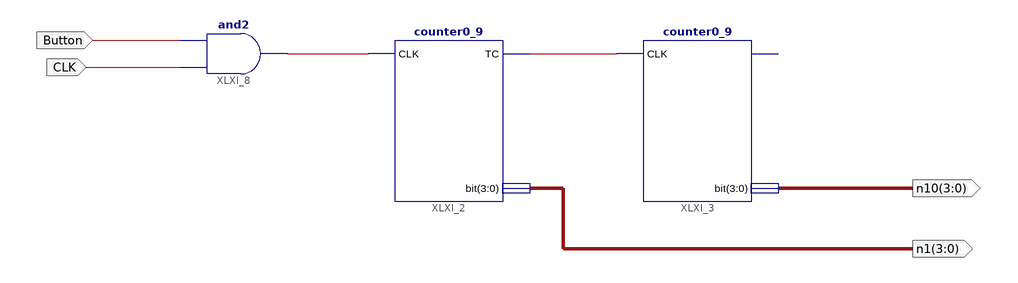
[diagram p0: schematic sheet 1]
// Xilinx ISE schematic Counter00_99.sch (spartan6) as structural Verilog: 3 symbols, 4 ports
module Counter00_99 (
  input  CLK,
  input  Button,
  output [3:0] n10,
  output [3:0] n1
);

  wire XLXN_3, XLXN_4;

  counter0_9 XLXI_2 (.CLK(XLXN_3), .\bit (n1), .TC(XLXN_4));
  counter0_9 XLXI_3 (.CLK(XLXN_4), .\bit (n10));  // open: TC
  and XLXI_8 (XLXN_3, CLK, Button);
endmodule
